# EAGLE design Teensy 3Gshield upper board V0.97 (EAGLE 7.2.0)
DESIGNER: Rob Oudendijk; VERSION: V 0.98
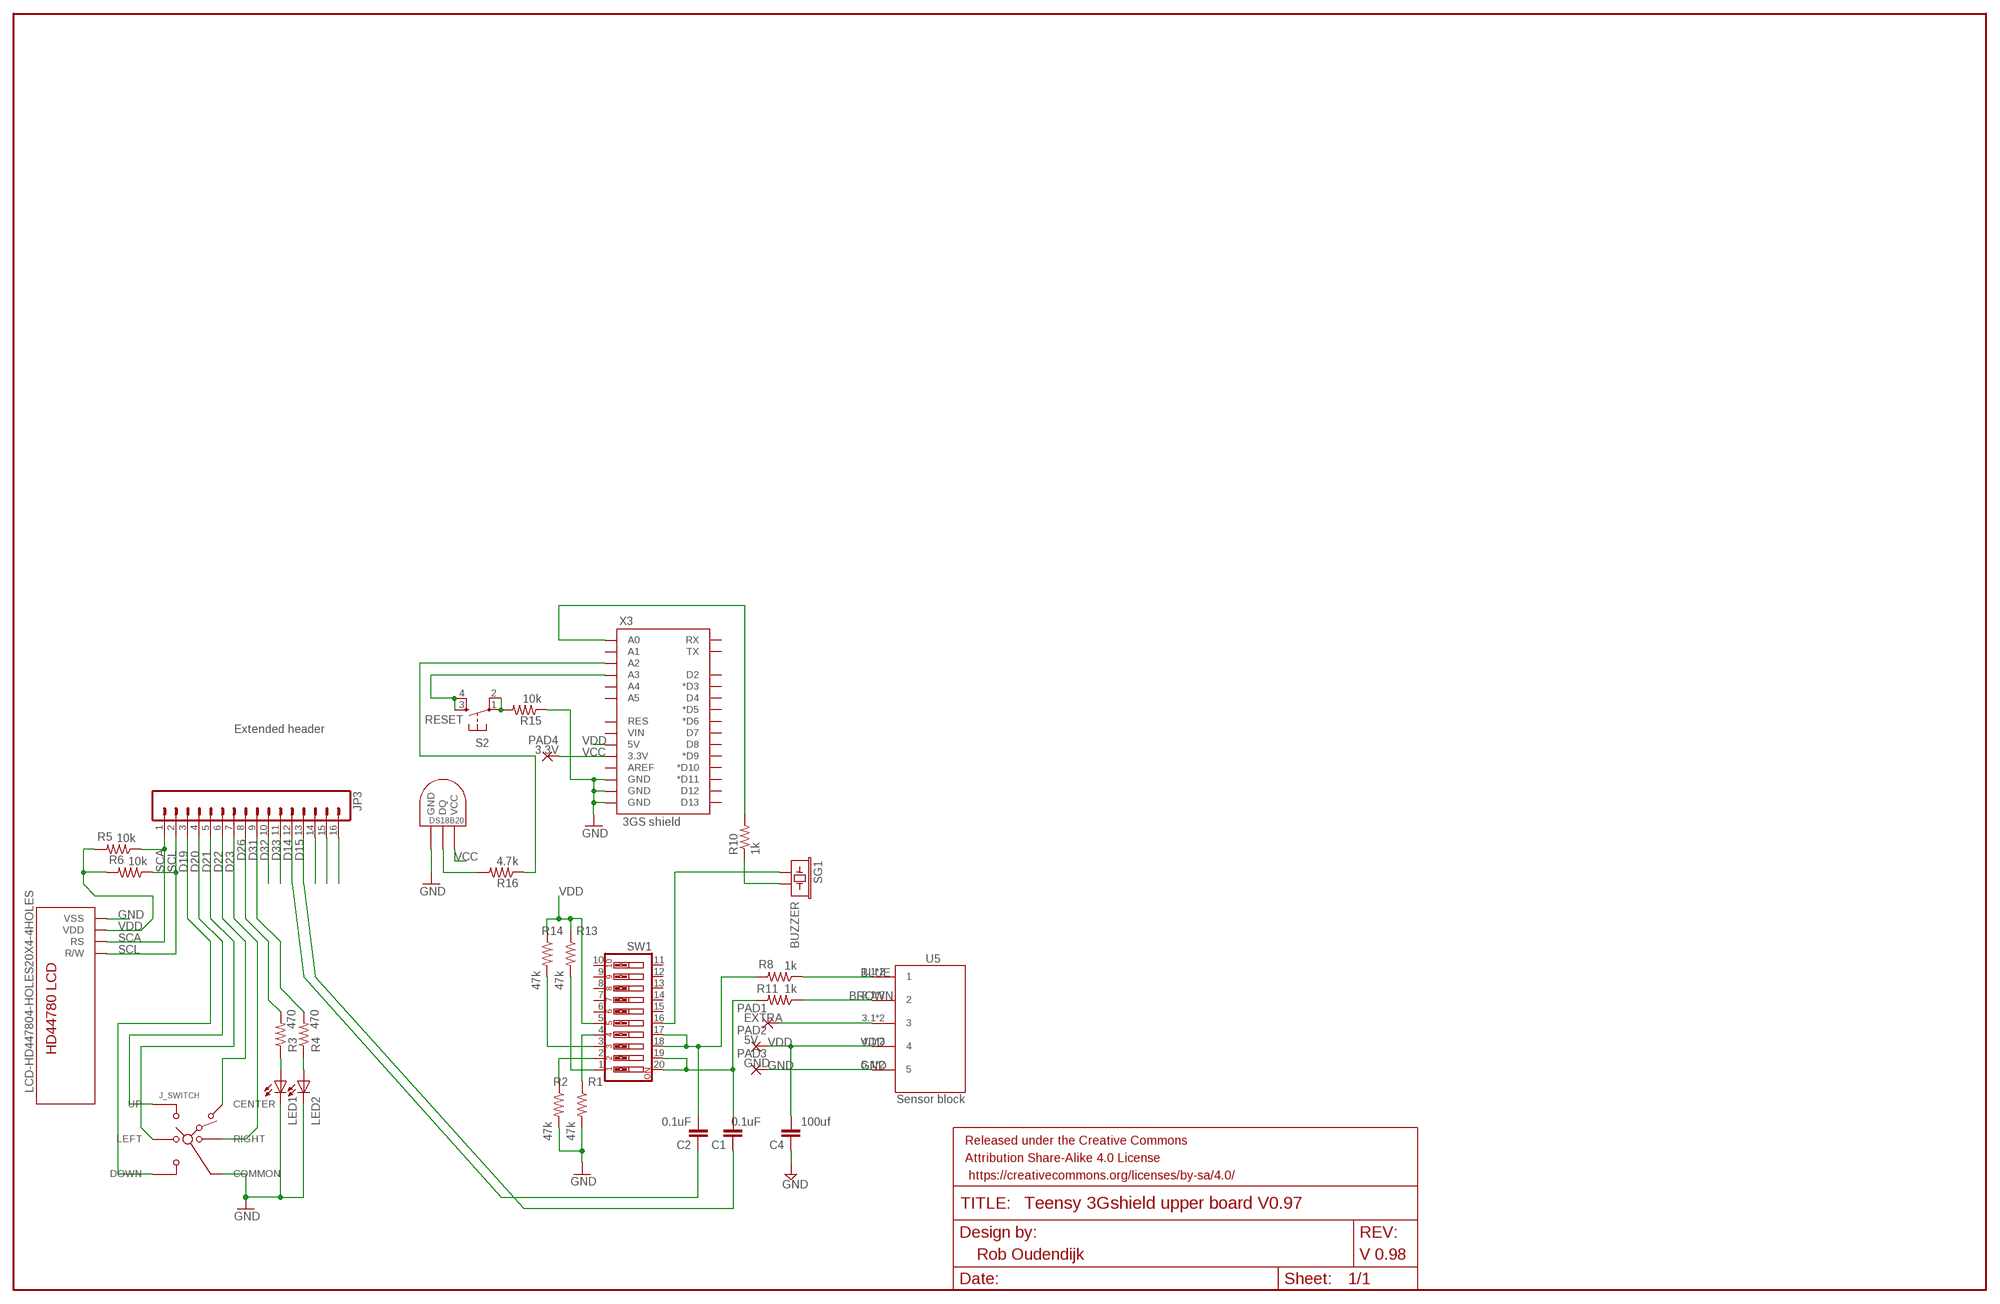
[diagram p0: schematic, sheet 1]

## Parts
C1  0.1uF  0.1UF-50V-20%(PTH)KIT-EZ  [CAP-PTH-SMALL-KIT]
C2  0.1uF  0.1UF-50V-20%(PTH)KIT-EZ  [CAP-PTH-SMALL-KIT]
C4  100uf  C-EU025-024X044  [C025-024X044]
FRAME1  FRAME-LEDGER  [CREATIVE_COMMONS]
J_SWITCH  SKQUCAA010  [SKQU]
JP3  Extended header  M16PTH  [1X16]
LED1  LED5MM  [LED5MM]
LED2  LED5MM  [LED5MM]
PAD1  EXTRA  2,15/1,0  [2,15/1,0]
PAD2  5V  2,15/1,0  [2,15/1,0]
PAD3  GND  2,15/1,0  [2,15/1,0]
PAD4  3.3V  2,15/1,0  [2,15/1,0]
R1  47k  RESISTORAXIAL-0.3  [AXIAL-0.3]
R2  47k  RESISTORAXIAL-0.3  [AXIAL-0.3]
R3  470  RESISTOREZ  [AXIAL-0.3EZ]
R4  470  RESISTOREZ  [AXIAL-0.3EZ]
R5  10k  RESISTORAXIAL-0.3  [AXIAL-0.3]
R6  10k  RESISTORAXIAL-0.3  [AXIAL-0.3]
R8  1k  RESISTORAXIAL-0.3  [AXIAL-0.3]
R10  1k  RESISTOREZ  [AXIAL-0.3EZ]
R11  1k  RESISTORAXIAL-0.3  [AXIAL-0.3]
R13  47k  RESISTORAXIAL-0.3  [AXIAL-0.3]
R14  47k  RESISTORAXIAL-0.3  [AXIAL-0.3]
R15  10k  RESISTOREZ  [AXIAL-0.3EZ]
R16  4.7k  RESISTOREZ  [AXIAL-0.3EZ]
S2  RESET  DTS-6  [DTS-6]
SG1  BUZZER  BUZZERPTH  [BUZZER-12MM]
SW1  SW_DIP-10  [EDG-10]
U5  Sensor block  SREWLESS_TERMINATOR_5PIN  [SREWLESS_TERMINATOR_5PIN]
U$2  DS1820TO92  [DS1820]
X1  LCD-HD447804-HOLES20X4-4HOLES  [LCD-20X4-4HOLES]
X3  3GS shield  ARDUINO_SHIELDLABEL  [DUEMILANOVE_SHIELD]

## Nets
BLUE: R8.P$1 U5.1.1 U5.1.2
BROWN: R11.P$1 U5.2.1 U5.2.2
D14: JP3.12
D15: JP3.13
D19: J_SWITCH.DOWN JP3.3
D20: J_SWITCH.UP JP3.4
D21: J_SWITCH.LEFT JP3.5
D22: J_SWITCH.CENTER JP3.6
D23: J_SWITCH.RIGHT JP3.7
D26: JP3.8 R3.P$2
D31: JP3.9 R4.P$2
D32: JP3.10
D33: JP3.11
GND [VCC]: C4.1 J_SWITCH.COMMON LED1.K(C) LED2.K(C) PAD3.1(P) R1.P$2 R2.P$2 R15.P$1 U5.5.1 U5.5.2 U$2.GND X1.P$13(VSS) X3.GND@0(GND) X3.GND@1(GND) X3.GND@2(GND)
N$1: SG1.+ SW1.16
N$2: JP3.14
N$3: LED1.A R3.P$1
N$4: JP3.15
N$5: R10.P$2 X3.A0
N$6: R14.P$2 SW1.3
N$8: C1.1
N$23: R10.P$1 SG1.-
N$24: R16.P$2 U$2.DQ
N$39: C1.2 R11.P$2 SW1.19 SW1.20
N$40: R16.P$1 X3.A2
N$43: R13.P$2 SW1.1
N$44: C2.1
N$62: LED2.A R4.P$1
N$84: R15.P$2 S2.1 S2.2
N$85: S2.3 S2.4 X3.A3
N$223: C2.2 R8.P$2 SW1.17 SW1.18
N$224: PAD1.1(P) U5.3.1 U5.3.2
N$244: JP3.16
SCA: JP3.1 R5.P$1 X1.P$15(RS)
SCL: JP3.2 R6.P$1 X1.P$16(R/W)
VCC: PAD4.1(P) U$2.VDD(VCC) X3.3.3V
VDD [VCC]: C4.2 PAD2.1(P) R5.P$2 R6.P$2 R13.P$1 R14.P$1 SW1.5 U5.4.1 U5.4.2 X1.P$14(VDD) X3.5V
VDD1: R1.P$1 R2.P$1 SW1.2 SW1.4
Unconnected: SW1.6 SW1.7 SW1.8 SW1.9 SW1.10 SW1.11 SW1.12 SW1.13 SW1.14 SW1.15 X3.A1 X3.A4 X3.A5 X3.AREF X3.D2 X3.D3(*D3) X3.D4 X3.D5(*D5) X3.D6(*D6) X3.D7 X3.D8 X3.D9(*D9) X3.D10(*D10) X3.D11(*D11) X3.D12 X3.D13 X3.RES X3.RX X3.TX X3.VIN

## Library data of the parts
C1 C2 = SparkFun-Capacitors:0.1UF-50V-20%(PTH): CAP-08370; PROD_ID: CAP-08370
C4 = rcl:C-EU: CAPACITOR, European symbol
FRAME1 = SparkFun-Aesthetics:FRAME-LEDGER: Schematic Frame Standard 11x14 US Ledger frame
J_SWITCH = joy_switch:SKQU: Multi Control Devices TACT Switch - 4-directional with Center Push Type. SKQU Series.; MF: ALPS; OC_ADAFRUIT: 504; OC_MOUSER: 688-SKQUCA; OC_NEWARK: 59M1983
JP3 = SparkFun-Connectors:M16: 1x16 .1" header
LED1 LED2 = adafruit:LED: LED OSRAM: - CHIPLED LG R971, LG N971, LY N971, LG Q971, LY Q971, LO R971, LY R971 LH N974, LH R974 LS Q976, LO Q976, LY Q976 LO Q996 - Hyper CHIPLED LW Q18S LB Q993, LB Q99A, LB R99A - SideLED LS A670, LO A670, LY A670, LG A670, LP A670 LB A673, LV A673, LT A673, LW A673 LH A674 LY A675 LS A676, LA A676, LO A676, LY A676, LW A676 LS A679, LY A679, LG A679 - Hyper Micro SIDELED® LS Y876, LA Y876, LO Y876, LY Y876 LT Y87S - SmartLED LW L88C, LW L88S LB L89C, LB L89S, LG L890 LS L89K, LO L89K, LY L89K LS L896, LA L896, LO L896, LY L896 - TOPLED LS T670, LO T670, LY T670, LG T670, LP T670 LSG T670, LSP T670, LSY T670, LOP T670, LYG T670 LG T671, LOG T671, LSG T671 LB T673, LV T673, LT T673, LW T673 LH T674 LS T676, LA T676, LO T676, LY T676, LB T676, LH T676, LSB T676, LW T676 LB T67C, LV T67C, LT T67C, LS T67K, LO T67K, LY T67K, LW E67C LS E67B, LA E67B, LO E67B, LY E67B, LB E67C, LV E67C, LT E67C LW T67C LS T679, LY T679, LG T679 LS T770, LO T770, LY T770, LG T770, LP T770 LB T773, LV T773, LT T773, LW T773 LH T774 LS E675, LA E675, LY E675, LS T675 LS T776, LA T776, LO T776, LY T776, LB T776 LHGB T686 LT T68C, LB T68C - Hyper Mini TOPLED® LB M676 - Mini TOPLED Santana® LG M470 LS M47K, LO M47K, LY M47K Source: http://www.osram.convergy.de/
PAD1-PAD4 = wirepad:2,15/1,0: THROUGH-HOLE PAD
R1 R2 R5 R6 R8 R11 R13 R14 = SparkFun:RESISTOR: Resistor Basic schematic elements and footprints for 0603, 1206, and PTH resistors.
R3 R4 R10 R15 R16 = SparkFun-Resistors:RESISTOR: Resistor Basic schematic elements and footprints for 0603, 1206, and PTH resistors.
S2 = switch-tact:DTS-6
SG1 = SparkFun:BUZZER: Buzzer 12mm Spark Fun Electronics SKU : Comp-Buzzer
SW1 = special:SW_DIP-10: DIP SWITCH
U5 = open_hw_sockets:SREWLESS_TERMINATOR_5PIN
U$2 = Ava:DS1820: DS18B20 Programmable Resolution 1-Wire Digital Thermometer Description The DS18B20 digital thermometer provides 9-bit to 12-bit Celsius temperature measurements and has an alarm function with nonvolatile user-programmable upper and lower trigger points. The DS18B20 communicates over a 1-Wire® bus that by definition requires only one data line (and ground) for communication with a central microprocessor. It has an operating temperature range of -55°C to +125°C and is accurate to ±0.5°C over the range of -10°C to +85°C. In addition, the DS18B20 can derive power directly from the data line ("parasite power"), eliminating the need for an external power supply. Each DS18B20 has a unique 64-bit serial code, which allows multiple DS18B20s to function on the same 1-Wire bus. Thus, it is simple to use one microprocessor to control many DS18B20s distributed over a large area. Applications that can benefit from this feature include HVAC environmental controls, temperature monitoring systems inside buildings, equipment, or machinery, and process monitoring and control systems.
X1 = LCD204_I2C:LCD-HD44780
X3 = SparkFun-Boards:ARDUINO_SHIELD: Arduino shield footprint

## Net classes
0 default: width 0.406 mm, drill 0.254 mm, clearance 0.305 mm
1 VCC: width 0.762 mm, drill 0.254 mm, clearance 0.205 mm to class 0, clearance 0.205 mm

## Board
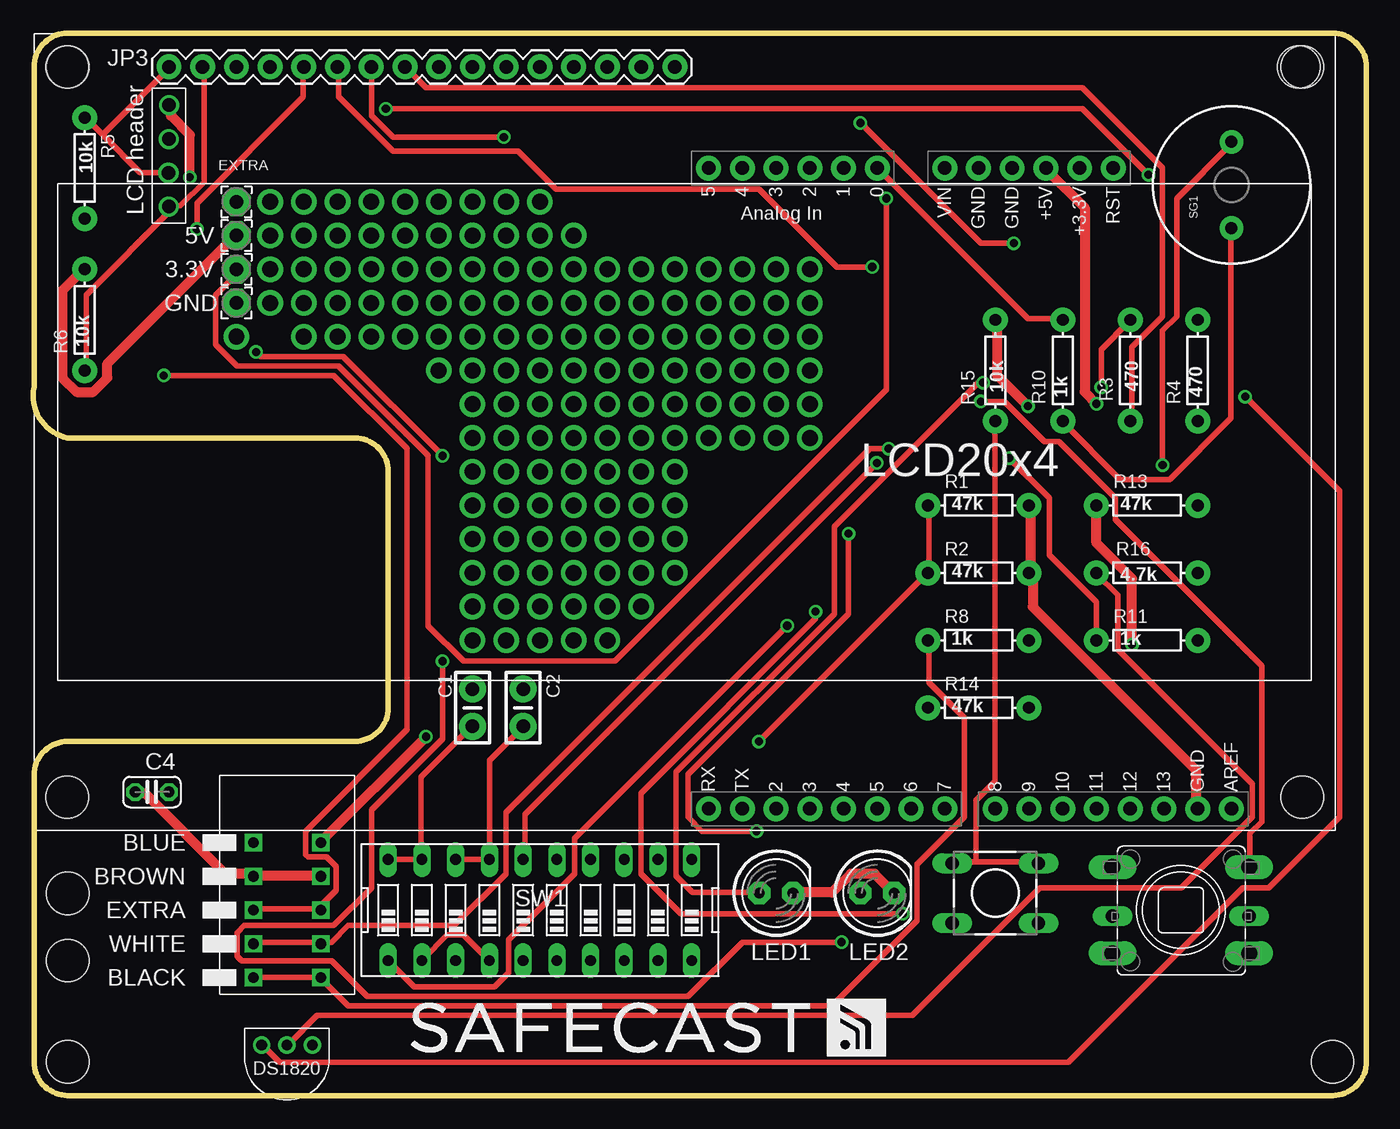
[diagram p1: board, top side]
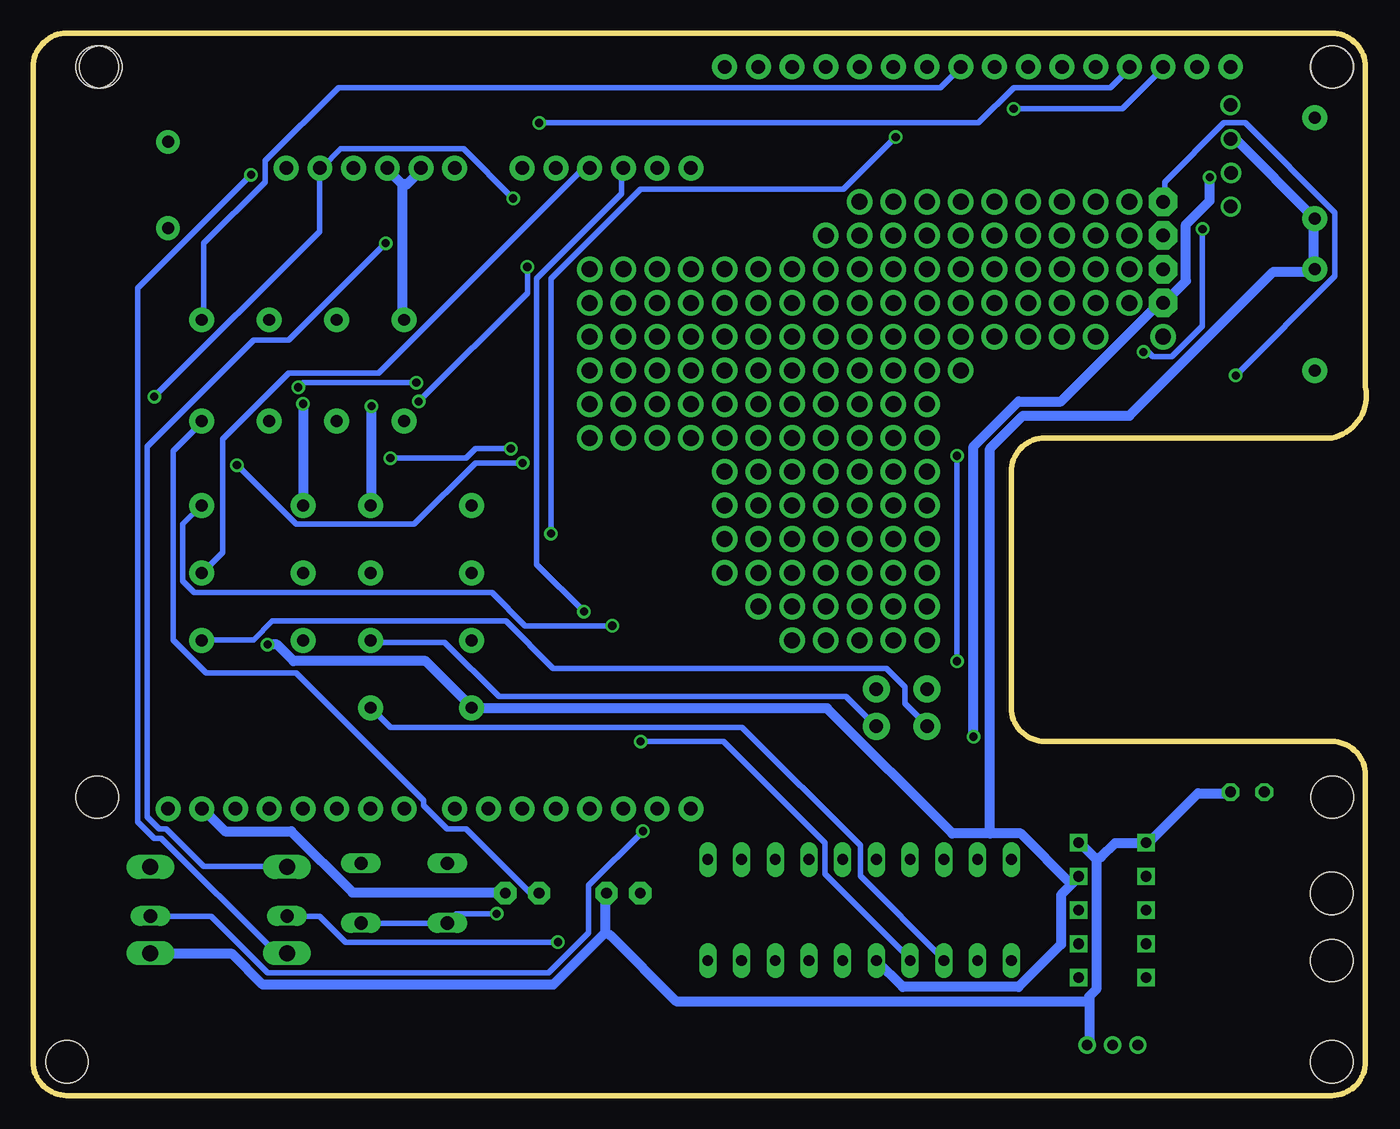
[diagram p2: board, bottom side, seen from below]

Size 100.39 x 80.01 mm. Coordinates in mm from the lower left corner, seen from the top.
Outline: 0.06,77.47 arc-90 2.6,80.01 97.85,80.01 arc-90 100.39,77.47 100.39,2.54 arc-90 97.85,0 2.6,0 arc-90 0.06,2.54 0.06,24.13 arc-90 2.6,26.67 24.19,26.67 arc90 26.73,29.21 26.73,46.99 arc90 24.19,49.53 2.6,49.53 arc-90 0.06,53.34 0.06,77.47
Copper layers (1*16): Top 0.035mm / dielectric 1.5mm / Bottom 0.035mm
Design rules "default": minimum track width 10mil, minimum drill 24mil, track to track 8mil, track to pad 8mil, pad to pad 8mil, via to via 8mil, smd to smd 8mil, copper to edge 40mil, drill to drill 8mil, minimum pad ring 10mil, minimum via ring 8mil, stop-mask expansion 4mil, vias tented up to drill 0mil, thermal gap 10mil
Holes 3.2 mm at 2.6,2.54 97.85,2.54 2.6,77.47 95.31,77.47 2.6,10.16 2.6,15.24

### Footprints (pad centres in the part's own frame; a part is rotated, then mirrored left to right if it is on the bottom)
CAP-PTH-SMALL-KIT = drill 1.016 pad 2.032: 1 -1.397,0; 2 1.397,0
C025-024X044 = drill 0.813 octagon: 1 -1.27,0; 2 1.27,0
SKQU = drill 1.2 long: CENTER 5.15,3.25; COMMON 5.15,-3.25; DOWN -5.15,-3.25; UP -5.15,3.25 | drill 1 long: LEFT -5.15,-0.45; RIGHT 5.15,-0.45
1X16 = drill 1.016 pad 1.88: 1 0,0; 2 2.54,0; 3 5.08,0; 4 7.62,0; 5 10.16,0; 6 12.7,0; 7 15.24,0; 8 17.78,0; 9 20.32,0; 10 22.86,0; 11 25.4,0; 12 27.94,0; 13 30.48,0; 14 33.02,0; 15 35.56,0; 16 38.1,0
LED5MM = drill 0.813 pad 1.676 octagon: A -1.27,0; K 1.27,0
2,15/1,0 = drill 1.016 pad 2.159 octagon: 1 0,0
AXIAL-0.3 = drill 0.9 pad 1.88: P$1 -3.81,0; P$2 3.81,0
AXIAL-0.3EZ = drill 0.9 pad 1.88: P$1 -3.81,0; P$2 3.81,0
DTS-6 = drill 1 long: 1 -3.25,2.25; 2 3.25,2.25; 3 -3.25,-2.25; 4 3.25,-2.25
BUZZER-12MM = drill 0.9 pad 1.778: + 3.25,0; - -3.25,0
EDG-10 = drill 0.813 long: 1 -11.43,-3.81; 2 -8.89,-3.81; 3 -6.35,-3.81; 4 -3.81,-3.81; 5 -1.27,-3.81; 6 1.27,-3.81; 7 3.81,-3.81; 8 6.35,-3.81; 9 8.89,-3.81; 10 11.43,-3.81; 11 11.43,3.81; 12 8.89,3.81; 13 6.35,3.81; 14 3.81,3.81; 15 1.27,3.81; 16 -1.27,3.81; 17 -3.81,3.81; 18 -6.35,3.81; 19 -8.89,3.81; 20 -11.43,3.81
SREWLESS_TERMINATOR_5PIN = drill 0.8 square: 1.1 -12.7,3.81; 1.2 -12.7,-1.27; 2.1 -10.16,3.81; 2.2 -10.16,-1.27; 3.1 -7.62,3.81; 3.2 -7.62,-1.27; 4.1 -5.08,3.81; 4.2 -5.08,-1.27; 5.1 -2.54,3.81; 5.2 -2.54,-1.27
DS1820 = drill 0.8: DQ 2.54,-1.27; GND 0.635,-1.27; VDD 4.445,-1.27
LCD-20X4-4HOLES = drill 1.016: P$13 10.17,54.621; P$14 10.149,52.059; P$15 10.127,49.522; P$16 10.149,46.983 | hole 3.2: 2.5,2.5; 2.5,57.5; 95.5,57.5; 95.5,2.5
DUEMILANOVE_SHIELD = drill 1.016 pad 1.88: 3.3V 12.7,27.94; 5V 10.16,27.94; A0 -2.54,27.94; A1 -5.08,27.94; A2 -7.62,27.94; A3 -10.16,27.94; A4 -12.7,27.94; A5 -15.24,27.94; AREF 24.13,-20.32; D2 -10.16,-20.32; D3 -7.62,-20.32; D4 -5.08,-20.32; D5 -2.54,-20.32; D6 0,-20.32; D7 2.54,-20.32; D8 6.35,-20.32; D9 8.89,-20.32; D10 11.43,-20.32; D11 13.97,-20.32; D12 16.51,-20.32; D13 19.05,-20.32; GND@0 7.62,27.94; GND@1 5.08,27.94; GND@2 21.59,-20.32; RES 15.24,27.94; RX -15.24,-20.32; TX -12.7,-20.32; VIN 2.54,27.94

### Placement (x,y rotation side)
C1  33.08,29.21 270 top
C2  36.89,29.21 270 top
C4  8.95,22.86 180 top
FRAME1  67.37,-2.29 0 top
J_SWITCH  86.42,13.97 0 top
JP3  10.22,77.47 0 top
LED1  55.94,15.24 0 top
LED2  63.56,15.24 0 top
PAD1  15.3,67.31 90 top
PAD2  15.3,64.77 90 top
PAD3  15.3,59.69 90 top
PAD4  15.3,62.23 90 top
R1  71.18,44.45 0 top
R2  71.18,39.37 0 top
R3  82.61,54.61 270 top
R4  87.69,54.61 90 top
R5  3.87,69.85 270 top
R6  3.87,58.42 90 top
R8  71.18,34.29 0 top
R10  77.53,54.61 90 top
R11  83.88,34.29 0 top
R13  83.88,44.45 0 top
R14  71.18,29.21 0 top
R15  72.45,54.61 270 top
R16  83.88,39.37 180 top
S2  72.45,15.24 0 top
SG1  90.23,68.58 90 top
SW1  38.16,13.97 0 top
U5  20.38,21.59 90 top
U$2  21.65,2.54 180 top
U$10  [SAFECAST_LOGO1]  28,2.54 0 top
X1  0.06,19.97 0 top
X3  66.1,41.91 0 top

### Tracks (layer width: path | path; a pad name or v marks a point on that pad's centre or on a via)
BLUE
  Top 0.406: U5.1.1 U5.1.2 21.75,8.71 23.71,6.76 60.16,6.76 66.56,13.16 66.56,17.42 70.12,20.98 70.12,28.45 67.45,31.11 67.45,34.14 R8.P$1
BROWN  (via drill 0.61)
  Top 0.406: U5.2.1 16.6,11.56 21.58,11.56 U5.2.2 21.75,11.56 22.47,11.56 23.71,12.8 31.71,12.8 35.62,16.71 35.62,21.34 63,48.72 v64.43,48.72 | R11.P$1 80.07,37.16 76.52,40.72 76.52,44.98 v73.49,48.01
  Bottom 0.406: v73.49,48.01 67.8,48.01 67.09,48.72 v64.43,48.72
D19  (via drill 0.61)
  Top 0.406: v83.98,69.34 79.01,74.32 v26.55,74.32
  Bottom 0.406: v83.98,69.34 92.52,60.81 92.52,20.62 91.27,19.38 90.74,19.38 82.21,10.85 81.32,10.85 J_SWITCH.DOWN | v26.55,74.32 18.38,74.32 15.35,77.34 JP3.3
D20  (via drill 0.61)
  Top 0.406: v73.85,64.19 71.36,64.19 v62.29,73.25
  Bottom 0.406: v73.85,64.19 81.14,56.9 83.81,56.9 91.81,48.9 91.81,20.98 90.92,20.09 90.38,20.09 87.54,17.25 81.32,17.25 J_SWITCH.UP | v62.29,73.25 29.22,73.25 26.55,75.92 19.26,75.92 17.84,77.34 JP3.4
D21  (via drill 0.61)
  Top 0.406: v60.87,11.56 53.4,11.56 49.31,7.47 25.13,7.47 22.47,10.13 15.71,10.13 15.35,10.49 15.35,12.27 15.89,12.8 22.64,12.8 25.49,15.65 25.49,21.51 30.82,26.85 v30.82,32.72 | v30.82,48.18 23.35,55.65 17.13,55.65 v16.78,56.01 | v12.33,65.25 12.33,67.21 20.33,75.21 20.33,77.34 JP3.5
  Bottom 0.406: v60.87,11.56 76.87,11.56 78.83,13.51 81.14,13.51 J_SWITCH.LEFT | v30.82,48.18 v30.82,32.72 | v16.78,56.01 16.42,56.01 16.06,55.65 14.64,55.65 12.33,57.96 v12.33,65.25
D22  (via drill 0.61)
  Top 0.406: v71.36,52.27 73.14,52.27 76.16,49.25 77.23,49.25 81.49,44.98 81.49,43.38 92.52,32.36 92.52,20.62 91.63,19.74 91.63,17.25 J_SWITCH.CENTER | v63.18,62.41 60.51,62.41 54.65,68.28 39.36,68.28 36.51,71.12 27.09,71.12 23,75.21 23,77.34 JP3.6
  Bottom 0.406: v71.36,52.27 63.18,60.45 v63.18,62.41
D23  (via drill 0.61)
  Top 0.406: v54.47,19.91 50.38,19.91 49.31,20.98 49.31,24.18 61.4,36.27 v61.4,42.32 | v35.44,72.19 27.09,72.19 25.49,73.79 25.49,77.34 JP3.7
  Bottom 0.406: v54.47,19.91 58.56,15.82 58.56,12.27 61.58,9.25 82.74,9.25 87.01,13.51 91.45,13.51 J_SWITCH.RIGHT | v61.4,42.32 61.4,61.52 54.65,68.28 39.36,68.28 v35.44,72.19
D26
  Top 0.406: R3.P$2 82.74,50.85 82.74,56.36 85.05,58.67 85.05,69.88 79.01,75.92 29.58,75.92 28.15,77.34 JP3.8
D31
  Bottom 0.406: R4.P$2 87.54,58.5 87.54,64.19 82.92,68.81 82.92,70.41 77.41,75.92 32.07,75.92 30.64,77.34 JP3.9
GND  (via drill 0.61)
  Top 0.762: v11.8,69.16 11.8,72.36 10.37,73.79 10.37,74.5 X1.P$13 | v29.58,27.03 21.75,19.2 U5.5.2 | LED2.K 63.36,16.71 61.58,16.71 60.16,15.29 57.31,15.29 LED1.K | R1.P$2 75.09,44.45 75.09,39.47 R2.P$2 75.27,39.12 75.27,36.8 87.54,24.54 87.54,21.69 X3.GND@2 | v74.92,51.92 72.6,54.23 72.6,58.32 R15.P$1
  Bottom 0.762: v11.8,69.16 11.8,67.39 13.58,65.61 13.58,61.34 15.18,59.74 PAD3.1 15.53,59.38 15.89,59.38 23,52.27 26.2,52.27 29.58,48.9 v29.58,27.03 | 20.87,7.11 20.87,7.47 20.33,8 20.33,17.78 | 20.87,7.11 20.87,3.91 U$2.GND | 20.33,17.78 21.58,19.02 U5.5.2 | 20.33,17.78 19.98,17.96 18.91,19.02 16.6,19.02 U5.5.1 16.24,19.2 12.69,22.76 10.37,22.76 C4.1 | 57.31,12.27 61.23,8.36 83.1,8.36 85.41,10.67 91.45,10.67 J_SWITCH.COMMON | 57.31,12.27 57.31,15.11 LED1.K | 72.6,68.63 72.6,58.5 R15.P$1 | 72.6,68.63 73.67,69.7 X3.GND@0 | X3.GND@1 71.18,69.7 72.25,68.63 72.6,68.63 | v74.92,51.92 74.92,44.45 R1.P$2 | LED2.K 64.96,15.29 76.34,15.29 80.96,19.91 85.94,19.91 87.54,21.51 X3.GND@2 | 20.87,7.11 51.98,7.11 56.96,12.09 57.31,12.27
N$1  (via drill 0.61)
  Top 0.406: v63.54,47.65 37.04,21.16 37.04,17.78 SW1.16 | v85.05,47.47 85.05,57.61 86.12,58.67 86.12,67.56 90.21,71.65 SG1.+
  Bottom 0.406: v63.54,47.65 67.09,47.65 71.72,43.03 80.61,43.03 v85.05,47.47
N$3  (via drill 0.61)
  Top 0.406: v71.54,53.7 71.18,53.7 60.34,42.85 60.34,36.27 48.42,24.36 48.42,16.54 49.67,15.29 54.65,15.29 LED1.A | v80.43,53.34 80.43,56.19 82.56,58.32 R3.P$1
  Bottom 0.406: v71.54,53.7 80.07,53.7 v80.43,53.34
N$5
  Top 0.406: X3.A0 74.92,58.5 77.41,58.5 R10.P$2
N$6
  Bottom 0.406: SW1.3 31.89,10.31 38.11,16.54 38.11,18.85 47,27.74 73.49,27.74 74.92,29.16 R14.P$2
N$7  (via drill 1.2 pad 1.93)
  other vias: 38.16,64.77
N$9  (via drill 1.2 pad 1.93)
  other vias: 45.78,46.99
N$10  (via drill 1.2 pad 1.93)
  other vias: 38.16,67.31
N$12  (via drill 1.2 pad 1.93)
  other vias: 43.24,52.07
N$13  (via drill 1.2 pad 1.93)
  other vias: 45.78,52.07
N$14  (via drill 1.2 pad 1.93)
  other vias: 43.24,49.53
N$15  (via drill 1.2 pad 1.93)
  other vias: 43.24,46.99
N$16  (via drill 1.2 pad 1.93)
  other vias: 48.32,46.99
N$17  (via drill 1.2 pad 1.93)
  other vias: 33.08,44.45
N$18  (via drill 1.2 pad 1.93)
  other vias: 33.08,41.91
N$19  (via drill 1.2 pad 1.93)
  other vias: 35.62,41.91
N$20  (via drill 1.2 pad 1.93)
  other vias: 35.62,44.45
N$21  (via drill 1.2 pad 1.93)
  other vias: 45.78,49.53
N$22  (via drill 1.2 pad 1.93)
  other vias: 38.16,44.45
N$23
  Top 0.406: SG1.- 90.21,65.25 90.21,51.03 85.58,46.41 81.85,46.41 77.58,50.67 R10.P$1
N$24
  Top 0.406: U$2.DQ 19.26,3.91 21.4,6.04 66.2,6.04 75.81,15.65 86.47,15.65 91.81,20.98 91.81,23.47 81.67,33.6 81.67,37.69 80.07,39.29 R16.P$2
N$25  (via drill 1.2 pad 1.93)
  other vias: 38.16,41.91
N$26  (via drill 1.2 pad 1.93)
  other vias: 40.7,41.91
N$27  (via drill 1.2 pad 1.93)
  other vias: 40.7,44.45
N$28  (via drill 1.2 pad 1.93)
  other vias: 43.24,44.45
N$29  (via drill 1.2 pad 1.93)
  other vias: 43.24,41.91
N$30  (via drill 1.2 pad 1.93)
  other vias: 45.78,41.91
N$31  (via drill 1.2 pad 1.93)
  other vias: 45.78,44.45
N$32  (via drill 1.2 pad 1.93)
  other vias: 43.24,39.37
N$33  (via drill 1.2 pad 1.93)
  other vias: 45.78,39.37
N$34  (via drill 1.2 pad 1.93)
  other vias: 33.08,39.37
N$35  (via drill 1.2 pad 1.93)
  other vias: 35.62,39.37
N$36  (via drill 1.2 pad 1.93)
  other vias: 38.16,39.37
N$37  (via drill 1.2 pad 1.93)
  other vias: 40.7,39.37
N$38  (via drill 1.2 pad 1.93)
  other vias: 43.24,36.83
N$39
  Top 0.406: SW1.20 SW1.19 29.22,17.96 29.22,24 32.96,27.74 C1.2
  Bottom 0.406: R11.P$2 87.54,34.31 83.81,34.31 82.38,35.74 64.78,35.74 61.23,32.18 36.16,32.18 34.73,30.76 34.73,29.52 33.13,27.91 C1.2
N$40
  Bottom 0.406: X3.A2 58.56,69.7 59.09,69.7 74.38,54.41 81.14,54.41 86.12,49.43 86.12,40.89 87.54,39.47 R16.P$1
N$41  (via drill 1.2 pad 1.93)
  other vias: 45.78,36.83
N$42  (via drill 1.2 pad 1.93)
  other vias: 43.24,34.29
N$43  (via drill 0.61)
  Top 0.406: v56.78,35.38 40.78,19.38 40.78,16.71 35.8,11.73 35.8,9.25 34.73,8.18 28.69,8.18 26.73,10.13 SW1.1
  Bottom 0.406: v56.78,35.38 63.36,35.38 65.85,37.87 88.25,37.87 89.14,38.76 89.14,43.03 87.72,44.45 R13.P$2
N$45  (via drill 1.2 pad 1.93)
  other vias: 25.46,57.15
N$46  (via drill 1.2 pad 1.93)
  other vias: 25.46,59.69
N$47  (via drill 1.2 pad 1.93)
  other vias: 25.46,62.23
N$48  (via drill 1.2 pad 1.93)
  other vias: 28,62.23
N$49  (via drill 1.2 pad 1.93)
  other vias: 28,59.69
N$50  (via drill 1.2 pad 1.93)
  other vias: 28,57.15
N$51  (via drill 1.2 pad 1.93)
  other vias: 30.54,57.15
N$52  (via drill 1.2 pad 1.93)
  other vias: 30.54,59.69
N$53  (via drill 1.2 pad 1.93)
  other vias: 30.54,62.23
N$55  (via drill 1.2 pad 1.93)
  other vias: 30.54,67.31
N$56  (via drill 1.2 pad 1.93)
  other vias: 25.46,67.31
N$57  (via drill 1.2 pad 1.93)
  other vias: 43.24,54.61
N$59  (via drill 1.2 pad 1.93)
  other vias: 45.78,54.61
N$60  (via drill 1.2 pad 1.93)
  other vias: 30.54,54.61
N$61  (via drill 1.2 pad 1.93)
  other vias: 48.32,54.61
N$62
  Bottom 0.406: LED2.A 62.29,15.29 63,15.29 67.8,20.09 69.23,20.09 71,21.87 71,22.23 80.61,31.83 87.36,31.83 89.85,34.31 89.85,48.54 87.72,50.67 R4.P$1
N$63  (via drill 1.2 pad 1.93)
  other vias: 48.32,52.07
N$64  (via drill 1.2 pad 1.93)
  other vias: 40.7,64.77
N$65  (via drill 1.2 pad 1.93)
  other vias: 48.32,49.53
N$66  (via drill 1.2 pad 1.93)
  other vias: 48.32,41.91
N$67  (via drill 1.2 pad 1.93)
  other vias: 48.32,44.45
N$68  (via drill 1.2 pad 1.93)
  other vias: 48.32,39.37
N$69  (via drill 1.2 pad 1.93)
  other vias: 38.16,62.23
N$70  (via drill 1.2 pad 1.93)
  other vias: 38.16,59.69
N$71  (via drill 1.2 pad 1.93)
  other vias: 40.7,59.69
N$72  (via drill 1.2 pad 1.93)
  other vias: 40.7,62.23
N$73  (via drill 1.2 pad 1.93)
  other vias: 38.16,57.15
N$74  (via drill 1.2 pad 1.93)
  other vias: 40.7,57.15
N$75  (via drill 1.2 pad 1.93)
  other vias: 17.84,62.23
N$78  (via drill 1.2 pad 1.93)
  other vias: 43.24,62.23
N$79  (via drill 1.2 pad 1.93)
  other vias: 43.24,59.69
N$80  (via drill 1.2 pad 1.93)
  other vias: 22.92,59.69
N$81  (via drill 1.2 pad 1.93)
  other vias: 45.78,59.69
N$82  (via drill 1.2 pad 1.93)
  other vias: 17.84,64.77
N$83  (via drill 1.2 pad 1.93)
  other vias: 20.38,64.77
N$84
  Top 0.406: 71,17.6 75.63,17.6 S2.2 | 71,17.6 69.23,17.6 S2.1 | 71,17.6 71,22.23 72.43,23.65 72.43,50.67 R15.P$2
N$85  (via drill 0.61)
  Top 0.406: v58.91,36.45 58.91,35.92 45.76,22.76 45.76,16.71 48.78,13.69 v65.49,13.69
  Bottom 0.406: S2.4 75.63,12.98 69.23,12.98 S2.3 69.05,13.16 68.52,13.69 v65.49,13.69 | v58.91,36.45 62.47,40.01 62.47,61.52 56.07,67.92 56.07,69.7 X3.A3
N$86  (via drill 1.2 pad 1.93)
  other vias: 20.38,62.23
N$87  (via drill 1.2 pad 1.93)
  other vias: 22.92,64.77
N$88  (via drill 1.2 pad 1.93)
  other vias: 48.32,59.69
N$89  (via drill 1.2 pad 1.93)
  other vias: 45.78,62.23
N$90  (via drill 1.2 pad 1.93)
  other vias: 43.24,57.15
N$91  (via drill 1.2 pad 1.93)
  other vias: 45.78,57.15
N$94  (via drill 1.2 pad 1.93)
  other vias: 48.32,62.23
N$95  (via drill 1.2 pad 1.93)
  other vias: 48.32,57.15
N$96  (via drill 1.2 pad 1.93)
  other vias: 50.86,54.61
N$97  (via drill 1.2 pad 1.93)
  other vias: 55.94,54.61
N$98  (via drill 1.2 pad 1.93)
  other vias: 58.48,54.61
N$99  (via drill 1.2 pad 1.93)
  other vias: 53.4,54.61
N$100  (via drill 1.2 pad 1.93)
  other vias: 50.86,49.53
N$101  (via drill 1.2 pad 1.93)
  other vias: 50.86,62.23
N$102  (via drill 1.2 pad 1.93)
  other vias: 50.86,59.69
N$103  (via drill 1.2 pad 1.93)
  other vias: 53.4,59.69
N$104  (via drill 1.2 pad 1.93)
  other vias: 53.4,62.23
N$105  (via drill 1.2 pad 1.93)
  other vias: 50.86,57.15
N$106  (via drill 1.2 pad 1.93)
  other vias: 22.92,62.23
N$107  (via drill 1.2 pad 1.93)
  other vias: 22.92,57.15
N$108  (via drill 1.2 pad 1.93)
  other vias: 20.38,57.15
N$109  (via drill 1.2 pad 1.93)
  other vias: 20.38,59.69
N$111  (via drill 1.2 pad 1.93)
  other vias: 17.84,59.69
N$112  (via drill 1.2 pad 1.93)
  other vias: 25.46,64.77
N$113  (via drill 1.2 pad 1.93)
  other vias: 28,64.77
N$114  (via drill 1.2 pad 1.93)
  other vias: 30.54,64.77
N$115  (via drill 1.2 pad 1.93)
  other vias: 15.3,57.15
N$116  (via drill 1.2 pad 1.93)
  other vias: 53.4,57.15
N$117  (via drill 1.2 pad 1.93)
  other vias: 55.94,62.23
N$118  (via drill 1.2 pad 1.93)
  other vias: 55.94,59.69
N$119  (via drill 1.2 pad 1.93)
  other vias: 58.48,59.69
N$120  (via drill 1.2 pad 1.93)
  other vias: 55.94,49.53
N$121  (via drill 1.2 pad 1.93)
  other vias: 58.48,62.23
N$122  (via drill 1.2 pad 1.93)
  other vias: 55.94,57.15
N$123  (via drill 1.2 pad 1.93)
  other vias: 58.48,57.15
N$124  (via drill 1.2 pad 1.93)
  other vias: 58.48,49.53
N$125  (via drill 1.2 pad 1.93)
  other vias: 53.4,49.53
N$126  (via drill 1.2 pad 1.93)
  other vias: 50.86,52.07
N$127  (via drill 1.2 pad 1.93)
  other vias: 53.4,52.07
N$128  (via drill 1.2 pad 1.93)
  other vias: 33.08,62.23
N$129  (via drill 1.2 pad 1.93)
  other vias: 33.08,64.77
N$130  (via drill 1.2 pad 1.93)
  other vias: 33.08,67.31
N$131  (via drill 1.2 pad 1.93)
  other vias: 35.62,67.31
N$132  (via drill 1.2 pad 1.93)
  other vias: 35.62,64.77
N$133  (via drill 1.2 pad 1.93)
  other vias: 35.62,62.23
N$134  (via drill 1.2 pad 1.93)
  other vias: 55.94,52.07
N$135  (via drill 1.2 pad 1.93)
  other vias: 58.48,52.07
N$148  (via drill 1.2 pad 1.93)
  other vias: 33.08,52.07
N$149  (via drill 1.2 pad 1.93)
  other vias: 33.08,54.61
N$150  (via drill 1.2 pad 1.93)
  other vias: 33.08,57.15
N$151  (via drill 1.2 pad 1.93)
  other vias: 33.08,59.69
N$152  (via drill 1.2 pad 1.93)
  other vias: 35.62,59.69
N$153  (via drill 1.2 pad 1.93)
  other vias: 35.62,57.15
N$154  (via drill 1.2 pad 1.93)
  other vias: 35.62,54.61
N$155  (via drill 1.2 pad 1.93)
  other vias: 35.62,52.07
N$156  (via drill 1.2 pad 1.93)
  other vias: 33.08,49.53
N$157  (via drill 1.2 pad 1.93)
  other vias: 33.08,46.99
N$158  (via drill 1.2 pad 1.93)
  other vias: 35.62,46.99
N$159  (via drill 1.2 pad 1.93)
  other vias: 35.62,49.53
N$160  (via drill 1.2 pad 1.93)
  other vias: 38.16,52.07
N$161  (via drill 1.2 pad 1.93)
  other vias: 38.16,54.61
N$166  (via drill 1.2 pad 1.93)
  other vias: 40.7,54.61
N$167  (via drill 1.2 pad 1.93)
  other vias: 40.7,52.07
N$168  (via drill 1.2 pad 1.93)
  other vias: 38.16,49.53
N$169  (via drill 1.2 pad 1.93)
  other vias: 38.16,46.99
N$170  (via drill 1.2 pad 1.93)
  other vias: 40.7,46.99
N$171  (via drill 1.2 pad 1.93)
  other vias: 40.7,49.53
N$212  (via drill 1.2 pad 1.93)
  other vias: 22.92,67.31
N$213  (via drill 1.2 pad 1.93)
  other vias: 20.38,67.31
N$214  (via drill 1.2 pad 1.93)
  other vias: 17.84,67.31
N$222  (via drill 1.2 pad 1.93)
  other vias: 28,67.31
N$223
  Top 0.406: SW1.18 SW1.17 34.38,17.96 34.38,25.25 36.87,27.74 C2.2
  Bottom 0.406: R8.P$2 74.92,34.14 69.4,34.14 65.32,30.05 39.18,30.05 37.04,27.91 C2.2
N$224  (via drill 0.61)
  Top 0.406: U5.3.1 16.6,14.05 21.58,14.05 U5.3.2 21.58,14.22 22.82,15.47 22.82,17.25 22.11,17.96 20.69,17.96 20.51,18.14 20.51,19.91 28.15,27.56 28.15,48.72 22.64,54.23 v9.84,54.23
  Bottom 0.406: v9.84,54.23 2.37,61.7 2.37,66.5 9.13,73.25 10.73,73.25 15.18,68.81 15.18,67.39 PAD1.1
N$229  (via drill 1.2 pad 1.93)
  other vias: 33.08,36.83
N$230  (via drill 1.2 pad 1.93)
  other vias: 35.62,36.83
N$231  (via drill 1.2 pad 1.93)
  other vias: 38.16,36.83
N$232  (via drill 1.2 pad 1.93)
  other vias: 40.7,36.83
N$237  (via drill 1.2 pad 1.93)
  other vias: 33.08,34.29
N$238  (via drill 1.2 pad 1.93)
  other vias: 35.62,34.29
N$239  (via drill 1.2 pad 1.93)
  other vias: 38.16,34.29
N$240  (via drill 1.2 pad 1.93)
  other vias: 40.7,34.29
SCA
  Top 0.406: 5.22,72.36 3.97,73.61 R5.P$1 | 5.22,72.36 8.06,69.52 10.02,69.52 X1.P$15 | 5.22,72.36 10.2,77.34 JP3.1
SCL
  Top 0.406: JP3.2 12.86,77.34 12.86,68.81 11.09,67.03 10.37,67.03 X1.P$16 10.55,66.85 3.97,60.27 3.97,54.76 R6.P$1
VCC  (via drill 0.61)
  Top 0.406: v91.27,52.63 98.39,45.52 98.39,20.98 93.05,15.65 91.1,15.65 77.94,2.49 18.55,2.49 17.31,3.73 U$2.VDD | v64.25,67.56 64.25,53.16 43.8,32.72 32.42,32.72 29.76,35.38 29.76,48.18 23,54.94 15.35,54.94 13.75,56.54 13.75,60.27 15.18,61.7 15.18,62.23 PAD4.1
  Bottom 0.406: v91.27,52.63 78.83,65.08 78.83,69.7 X3.3.3V 78.65,69.88 77.23,71.3 67.98,71.3 v64.25,67.56
VDD  (via drill 0.61)
  Top 0.762: v80.07,52.09 79.18,52.98 79.18,66.85 76.34,69.7 X3.5V | PAD2.1 15.18,64.72 5.57,55.12 5.57,54.05 4.51,52.98 3.26,52.98 2.2,54.05 2.2,60.63 3.8,62.23 R6.P$2 | U5.4.2 21.58,16.54 16.6,16.54 U5.4.1 16.24,16.71 14.46,16.71 8.42,22.76 7.71,22.76 C4.2 | R13.P$1 80.07,41.6 82.74,38.94 v82.74,33.96
  Bottom 0.762: v80.07,52.09 R13.P$1 | X1.P$14 10.2,72.01 9.84,72.01 R5.P$2 3.97,65.79 3.97,62.23 R6.P$2 4.33,62.05 7,62.05 17.84,51.21 25.84,51.21 28.33,48.72 28.33,19.74 | SW1.5 34.91,8.18 26.2,8.18 23,11.38 23,15.11 22.2,15.91 | 22.2,15.91 21.75,16.36 U5.4.2 | 28.33,19.74 26.02,19.74 22.2,15.91 | 28.33,19.74 31.18,19.74 40.6,29.16 67.27,29.16 R14.P$1 67.63,29.52 70.83,32.72 80.78,32.72 82.03,33.96 v82.74,33.96
VDD1  (via drill 0.61)
  Top 0.406: SW1.4 32.42,12.09 31.18,12.09 29.4,10.31 SW1.2 | R1.P$1 67.45,44.45 67.45,39.47 R2.P$1 67.27,39.29 v54.65,26.67
  Bottom 0.406: v54.65,26.67 48.42,26.67 40.78,19.02 40.78,16.71 34.38,10.31 SW1.4

### Text on the board
tDocu: nGeigieKit V2.0